# Altium project TB Power supply pcb.PrjPcb
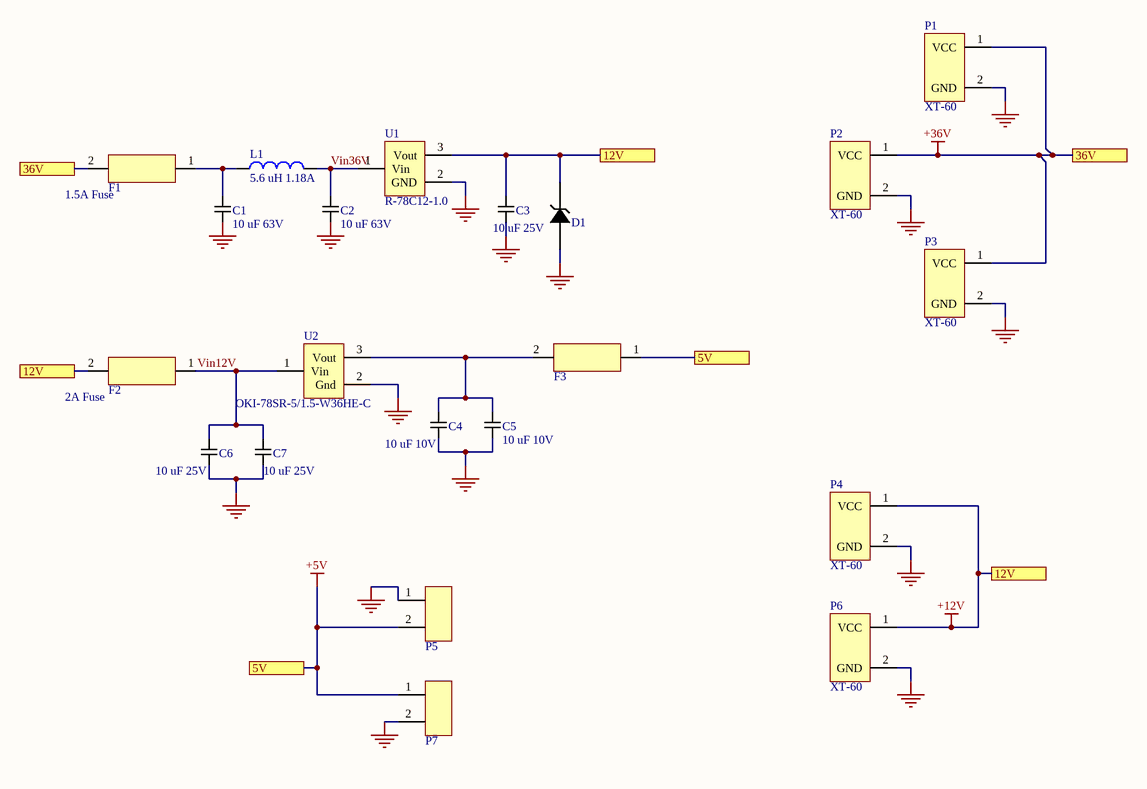
[diagram p0: TB Power supply pcb.SchDoc]
1 sheet, 21 parts. Net scope: flat (ports and power ports of the same name join across sheets).
Board file: TB Power supply pcb.PcbDoc

## Sheet TB Power supply pcb.SchDoc
size A4

### Parts
C1  value 10 uF 63V  [C_smd_3225]  (hidden comment: SMD)
C2  value 10 uF 63V  [C_smd_3225]  (hidden comment: SMD)
C3  value 10 uF 25V  [C_SMD_0805_pcb]  (hidden comment: SMD)
C4  value 10 uF 10V  [C_SMD_0805_pcb]  (hidden comment: SMD)
C5  value 10 uF 10V  [C_SMD_0805_pcb]  (hidden comment: SMD)
C6  value 10 uF 25V  [C_SMD_0805_pcb]  (hidden comment: SMD)
C7  value 10 uF 25V  [C_SMD_0805_pcb]  (hidden comment: SMD)
D1  D_ZENER_smd_13V  [D_ZENER_12V_smd]  (value not drawn)
F1  value 1.5A Fuse  [fuse_holder_3A]  (hidden comment: Fuse-holder-3A)
F2  value 2A Fuse  [fuse_holder_3A]  (hidden comment: Fuse-holder-3A)
F3  Fuse-holder-3A  [fuse_holder_3A]  (value not drawn)
L1  value 5.6 uH 1.18A  [L_1.18A_4532]  (hidden comment: L_1.18A_4532)
P1  XT-60  [XT-60]
P2  XT-60  [XT-60]
P3  XT-60  [XT-60]
P4  XT-60  [XT-60]
P5  JST_SE_2PIN  [JST_SE_2PIN]  (value not drawn)
P6  XT-60  [XT-60]
P7  JST_SE_2PIN  [JST_SE_2PIN]  (value not drawn)
U1  R-78C12-1.0  [R-78C12-1.0]
U2  OKI-78SR-5/1.5-W36HE-C  [OKI-78SR-5/1.5-W36HE-C]

### Ports
5V, 12V, 36V

### Nets
+5V: F3.1(VIN) P5.2 P7.1 ; port 5V
+12V: C3.1 D1.2 F2.2(VIN) P4.1(VCC) P6.1(VCC) U1.3(Vout) ; port 12V
+36V: F1.2(VIN) P1.1(VCC) P2.1(VCC) P3.1(VCC) ; port 36V
GND: C1.2 C2.2 C3.2 C4.2 C5.2 C6.2 C7.2 D1.1 P1.2(GND) P2.2(GND) P3.2(GND) P4.2(GND) P5.1 P6.2(GND) P7.2 U1.2(GND) U2.2(Gnd)
Vin12V: C6.1 C7.1 F2.1(VIN) U2.1(Vin)
Vin36V: C2.1 L1.2 U1.1(Vin)
NetC1_1: C1.1 F1.1(VIN) L1.1
NetC4_1: C4.1 C5.1 F3.2(VIN) U2.3(Vout)

### Library data of the parts
C1 C2 = C_SMD_3225: Supplier 1: *; Supplier Part Number 1: *
C3-C7 = C_SMD_0805: Supplier 1: *; Supplier Part Number 1: *
F1-F3 = Fuse-holder-3A: (22.352mm x6.858mm); ComponentLink1Description: datasheet; ComponentLink1URL: https://www.littelfuse.com/~/media/electronics/datasheets/fuse_clips/littelfuse_fuse_clip_111_datasheet.pdf.pdf; Parameter 2: *
  F3: value: *
U1 = R-78C12-1.0: Wide input - 12V out buck; Value: *
U2 = OKI-78SR-5/1.5-W36HE-C: 12V-5V buck; Value: *
D1 = D_ZENER_smd_13V: Supplier Part Number 1: *; Supplier 1: *; Value: *
L1 = L_1.18A_4532: Category: Inductor
P1-P4 P6 = XT-60: Supplier Part Number 1: *; Supplier 1: *
P5 P7 = JST_SE_2PIN: Supplier 1: *; Supplier Part Number 1: *